# Altium schematic sheet 2014_FDP_STRATEGIE.SchDoc
size A2
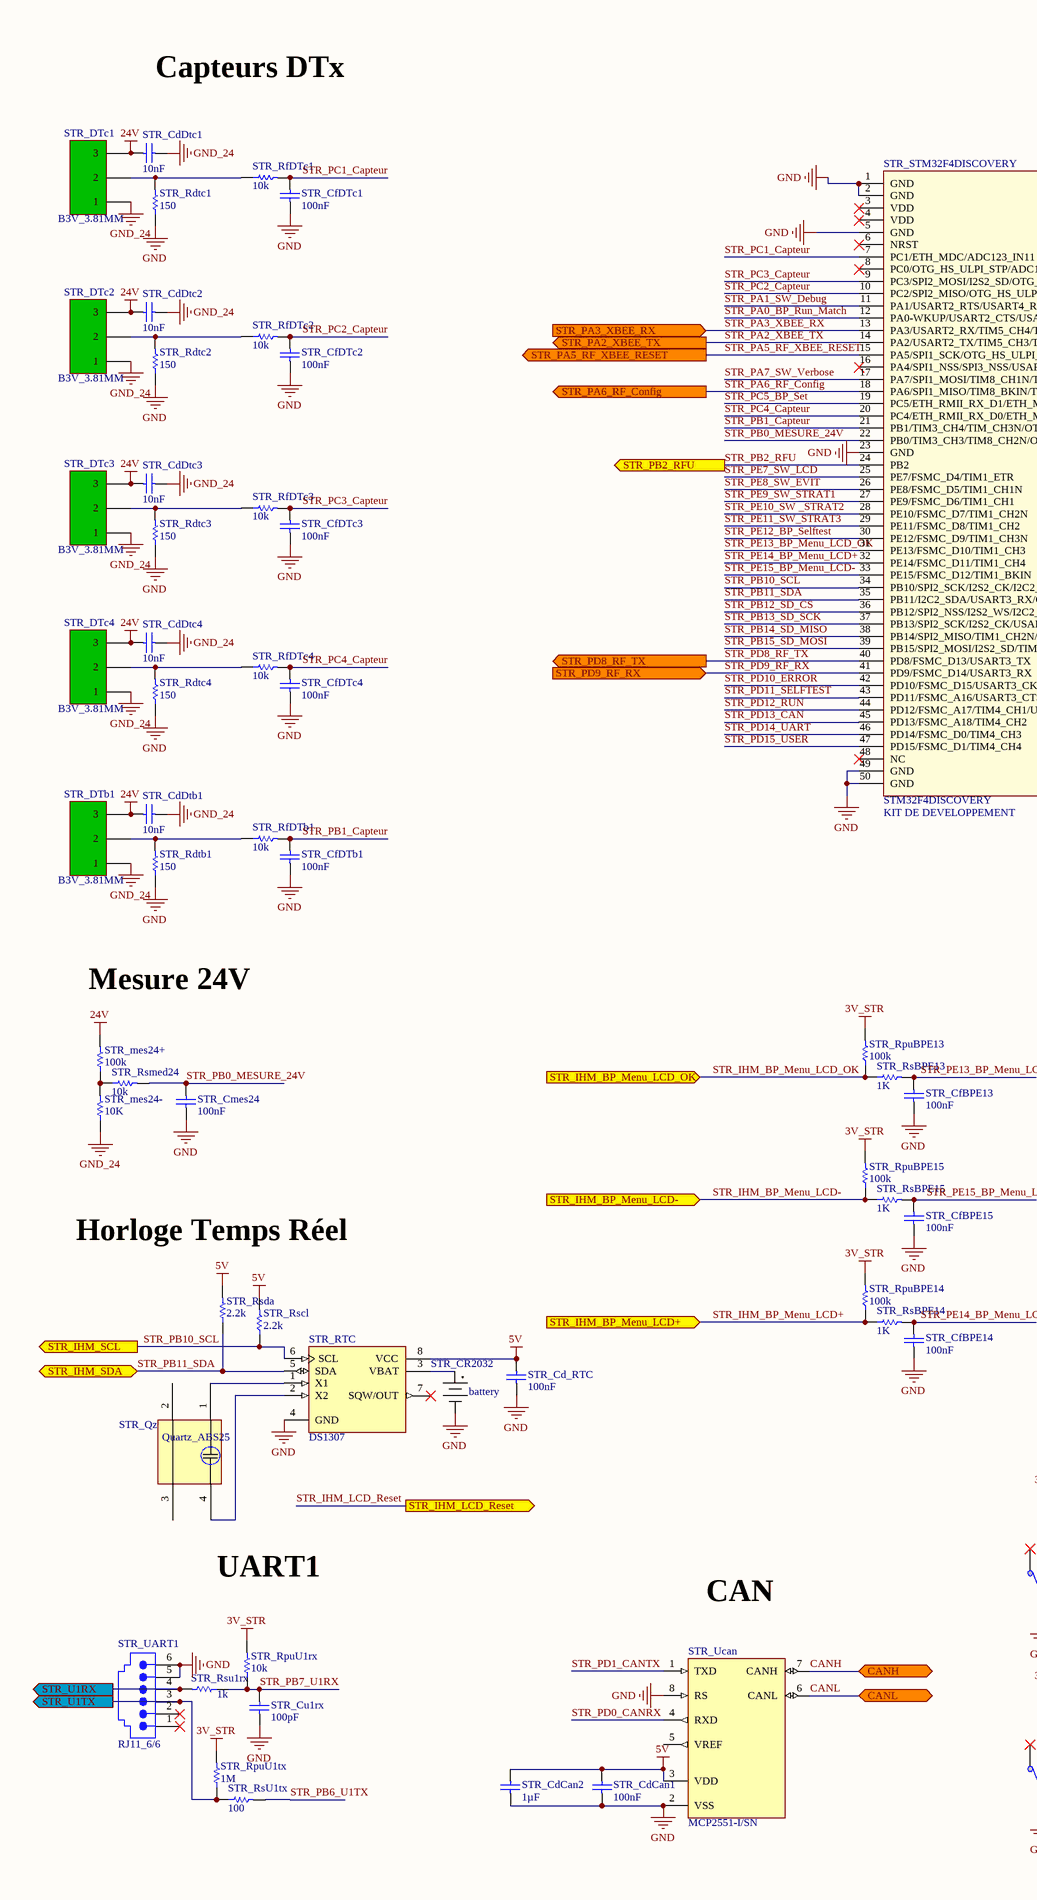
[diagram p0: 2014_FDP_STRATEGIE.SchDoc, left]
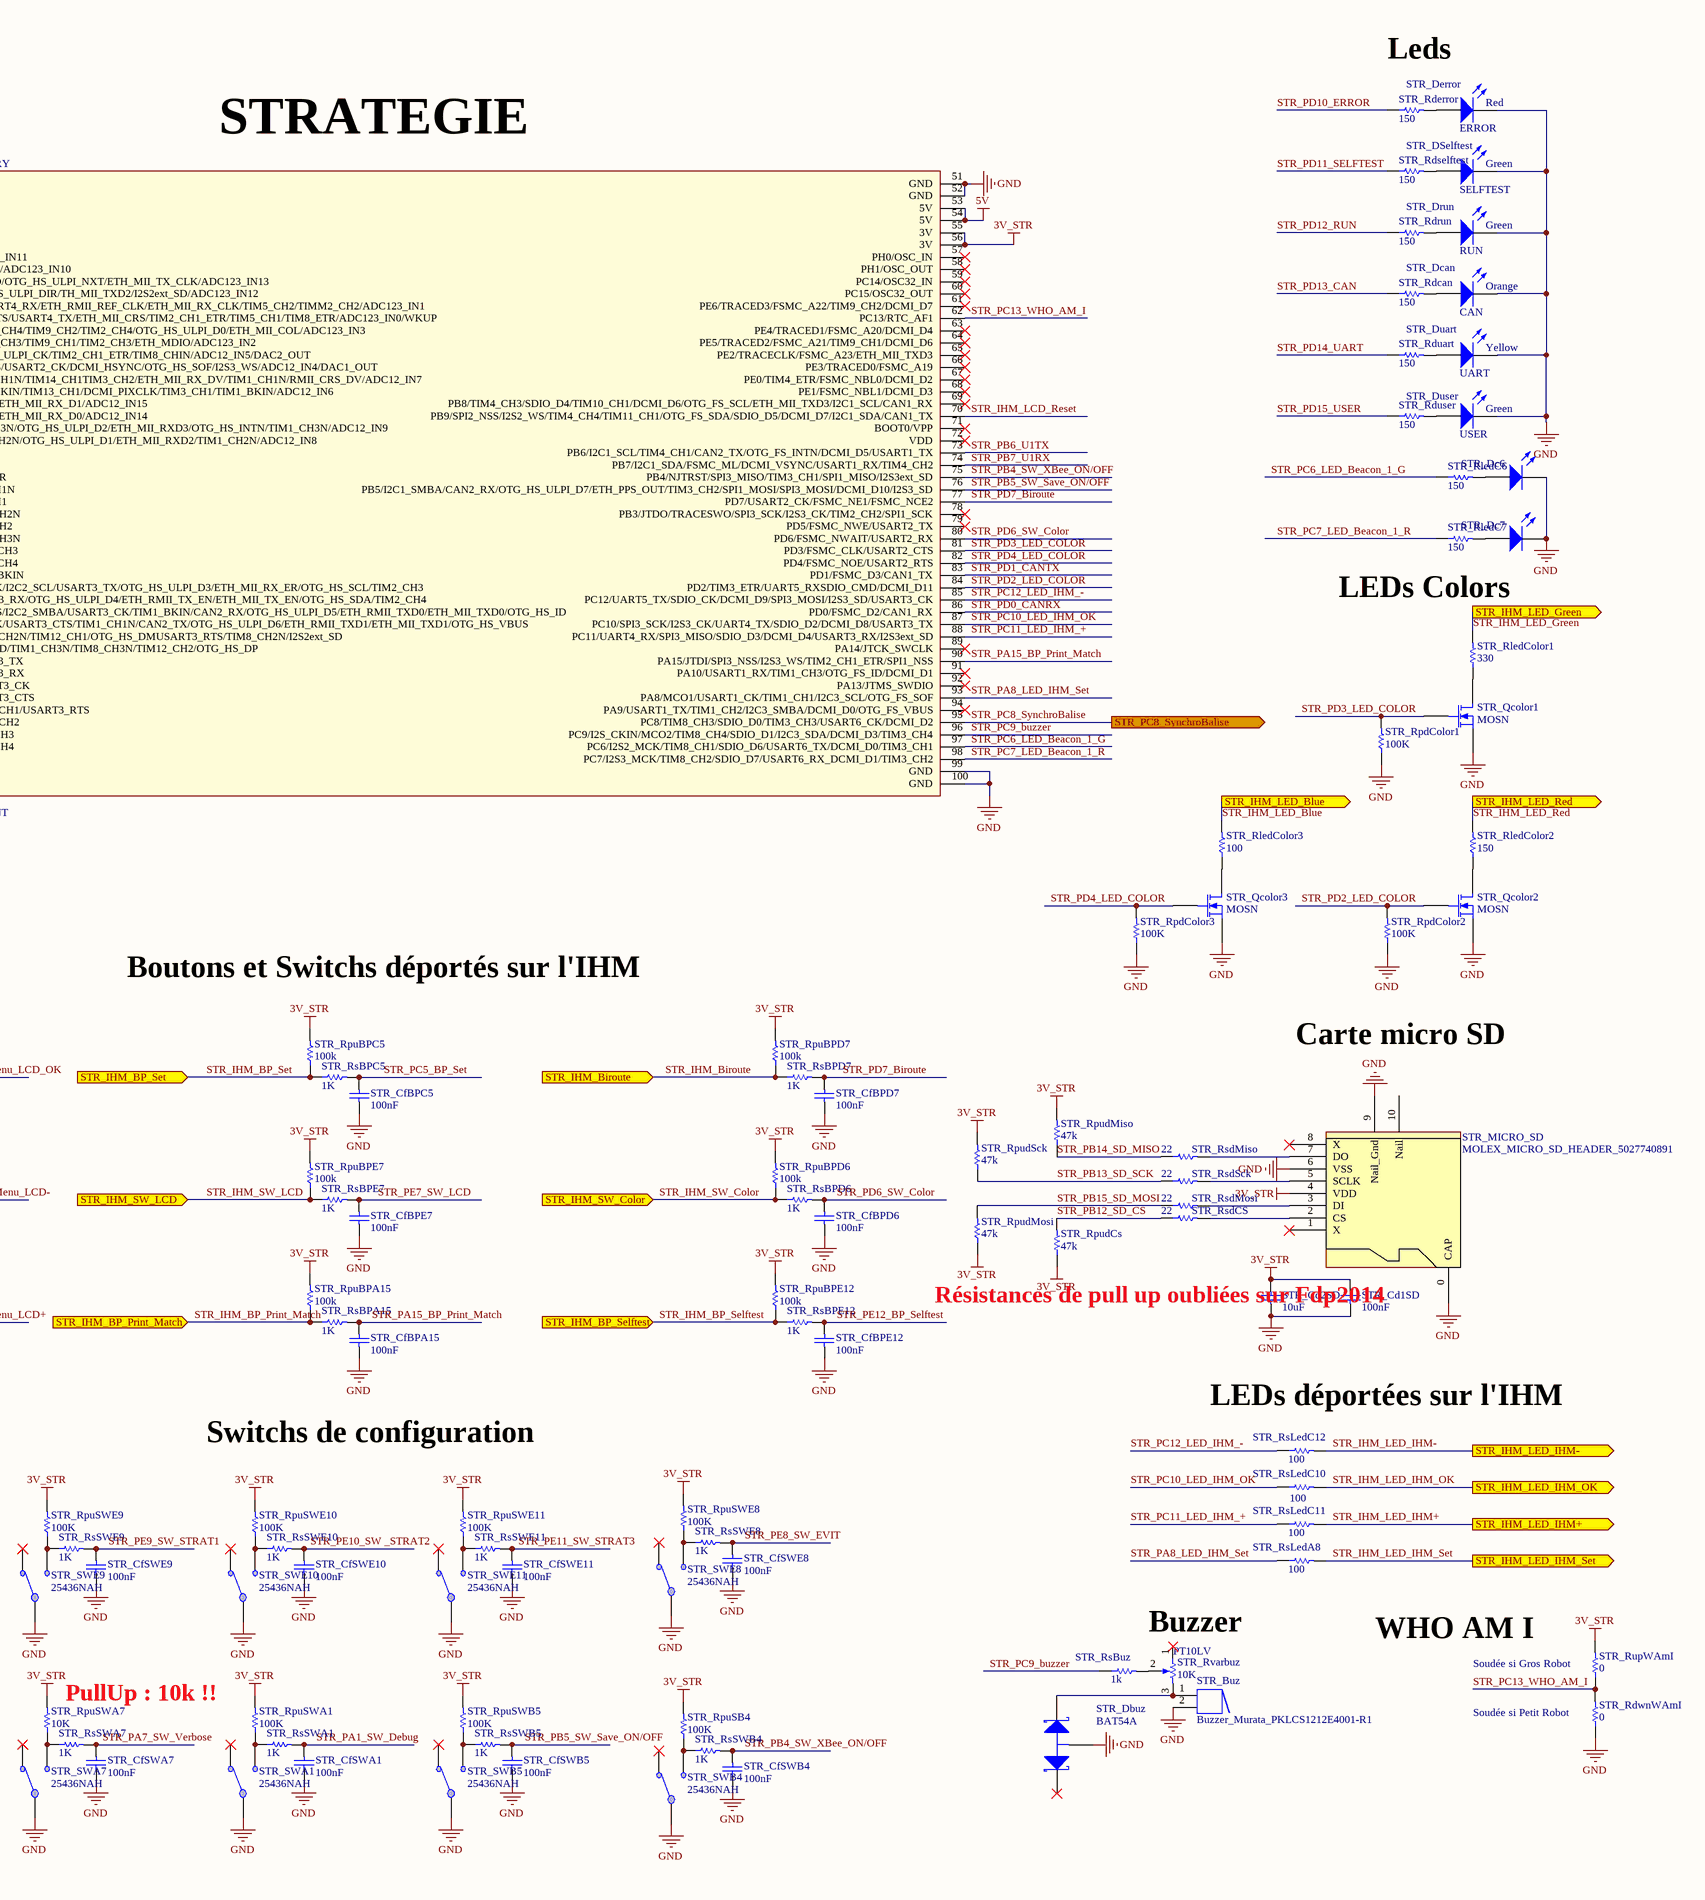
[diagram p1: 2014_FDP_STRATEGIE.SchDoc, right]

## Parts
STR_Buz  Buzzer_Murata_PKLCS1212E4001-R1  [Buzzer_Murata PKLCS1212]
STR_Cd1SD  100nF  [C0805_N]
STR_Cd2SD  10uF  [C1206_N]
STR_Cd_RTC  100nF  [C0805_N]
STR_CdCan1  100nF  [C0805_N]
STR_CdCan2  1µF  [C0805_N]
STR_CdDtb1  10nF  [C0805_N]
STR_CdDtc1  10nF  [C0805_N]
STR_CdDtc2  10nF  [C0805_N]
STR_CdDtc3  10nF  [C0805_N]
STR_CdDtc4  10nF  [C0805_N]
STR_CfBPA15  100nF  [C0805_N]
STR_CfBPC5  100nF  [C0805_N]
STR_CfBPD6  100nF  [C0805_N]
STR_CfBPD7  100nF  [C0805_N]
STR_CfBPE7  100nF  [C0805_N]
STR_CfBPE12  100nF  [C0805_N]
STR_CfBPE13  100nF  [C0805_N]
STR_CfBPE14  100nF  [C0805_N]
STR_CfBPE15  100nF  [C0805_N]
STR_CfDTb1  100nF  [C0805_N]
STR_CfDTc1  100nF  [C0805_N]
STR_CfDTc2  100nF  [C0805_N]
STR_CfDTc3  100nF  [C0805_N]
STR_CfDTc4  100nF  [C0805_N]
STR_CfSWA1  100nF  [C0805_N]
STR_CfSWA7  100nF  [C0805_N]
STR_CfSWB4  100nF  [C0805_N]
STR_CfSWB5  100nF  [C0805_N]
STR_CfSWE8  100nF  [C0805_N]
STR_CfSWE9  100nF  [C0805_N]
STR_CfSWE10  100nF  [C0805_N]
STR_CfSWE11  100nF  [C0805_N]
STR_Cmes24  100nF  [C0805_N]
STR_CR2032  battery  [Pile_boutton]
STR_Cu1rx  100pF  [C0805_N]
STR_Dbuz  BAT54A  [SOT23-3N]
STR_Dc6  ??  [LED_0805]  (value not drawn)
STR_Dc7  ??  [LED_0805]  (value not drawn)
STR_Dcan  CAN  [LED_0805]
STR_Derror  ERROR  [LED_0805]
STR_Drun  RUN  [LED_0805]
STR_DSelftest  SELFTEST  [LED_0805]
STR_DTb1  B3V_3.81MM  [BORNIER_3V_3.81MM]
STR_DTc1  B3V_3.81MM  [BORNIER_3V_3.81MM]
STR_DTc2  B3V_3.81MM  [BORNIER_3V_3.81MM]
STR_DTc3  B3V_3.81MM  [BORNIER_3V_3.81MM]
STR_DTc4  B3V_3.81MM  [BORNIER_3V_3.81MM]
STR_Duart  UART  [LED_0805]
STR_Duser  USER  [LED_0805]
STR_mes24+  100k  [R1206_N]
STR_mes24-  10K  [R1206_N]
STR_MICRO_SD  MOLEX_MICRO_SD_HEADER_5027740891  [MOLEX_MICRO_SD_HEADER_5027740891]
STR_Qcolor1  MOSN  [SOT23-3N]
STR_Qcolor2  MOSN  [SOT23-3N]
STR_Qcolor3  MOSN  [SOT23-3N]
STR_Qz  Quartz_ABS25  [Quartz_ABS25]
STR_Rdcan  150  [R1206_N]
STR_Rderror  150  [R1206_N]
STR_Rdrun  150  [R1206_N]
STR_Rdselftest  150  [R1206_N]
STR_Rdtb1  150  [R1206_N]
STR_Rdtc1  150  [R1206_N]
STR_Rdtc2  150  [R1206_N]
STR_Rdtc3  150  [R1206_N]
STR_Rdtc4  150  [R1206_N]
STR_Rduart  150  [R1206_N]
STR_Rduser  150  [R1206_N]
STR_RdwnWAmI  0  [R1206_N]
STR_RfDTb1  10k  [R1206_N]
STR_RfDTc1  10k  [R1206_N]
STR_RfDTc2  10k  [R1206_N]
STR_RfDTc3  10k  [R1206_N]
STR_RfDTc4  10k  [R1206_N]
STR_RledC6  150  [R1206_N]
STR_RledC7  150  [R1206_N]
STR_RledColor1  330  [R1206_N]
STR_RledColor2  150  [R1206_N]
STR_RledColor3  100  [R1206_N]
STR_RpdColor1  100K  [R1206_N]
STR_RpdColor2  100K  [R1206_N]
STR_RpdColor3  100K  [R1206_N]
STR_RpuBPA15  100k  [R1206_N]
STR_RpuBPC5  100k  [R1206_N]
STR_RpuBPD6  100k  [R1206_N]
STR_RpuBPD7  100k  [R1206_N]
STR_RpuBPE7  100k  [R1206_N]
STR_RpuBPE12  100k  [R1206_N]
STR_RpuBPE13  100k  [R1206_N]
STR_RpuBPE14  100k  [R1206_N]
STR_RpuBPE15  100k  [R1206_N]
STR_RpudCs  47k  [R1206_N]
STR_RpudMiso  47k  [R1206_N]
STR_RpudMosi  47k  [R1206_N]
STR_RpudSck  47k  [R1206_N]
STR_RpuSB4  100K  [R1206_N]
STR_RpuSWA1  100K  [R1206_N]
STR_RpuSWA7  10K  [R1206_N]
STR_RpuSWB5  100K  [R1206_N]
STR_RpuSWE8  100K  [R1206_N]
STR_RpuSWE9  100K  [R1206_N]
STR_RpuSWE10  100K  [R1206_N]
STR_RpuSWE11  100K  [R1206_N]
STR_RpuU1rx  10k  [R1206_N]
STR_RpuU1tx  1M  [R1206_N]
STR_RsBPA15  1K  [R1206_N]
STR_RsBPC5  1K  [R1206_N]
STR_RsBPD6  1K  [R1206_N]
STR_RsBPD7  1K  [R1206_N]
STR_RsBPE7  1K  [R1206_N]
STR_RsBPE12  1K  [R1206_N]
STR_RsBPE13  1K  [R1206_N]
STR_RsBPE14  1K  [R1206_N]
STR_RsBPE15  1K  [R1206_N]
STR_RsBuz  1k  [R1206_N]
STR_Rscl  2.2k  [R1206_N]
STR_Rsda  2.2k  [R1206_N]
STR_RsdCS  22  [R1206_N]
STR_RsdMiso  22  [R1206_N]
STR_RsdMosi  22  [R1206_N]
STR_RsdSck  22  [R1206_N]
STR_RsLedA8  100  [R1206_N]
STR_RsLedC10  100  [R1206_N]
STR_RsLedC11  100  [R1206_N]
STR_RsLedC12  100  [R1206_N]
STR_Rsmed24  10k  [R1206_N]
STR_RsSWA1  1K  [R1206_N]
STR_RsSWA7  1K  [R1206_N]
STR_RsSWB4  1K  [R1206_N]
STR_RsSWB5  1K  [R1206_N]
STR_RsSWE8  1K  [R1206_N]
STR_RsSWE9  1K  [R1206_N]
STR_RsSWE10  1K  [R1206_N]
STR_RsSWE11  1K  [R1206_N]
STR_Rsu1rx  1k  [R1206_N]
STR_RsU1tx  100  [R1206_N]
STR_RTC  DS1307  [SO8_N]
STR_RupWAmI  0  [R1206_N]
STR_Rvarbuz  value 10K  Type: PT10LV  [TRIMMER_MONOTOUR_PT10LV]  (hidden comment: RESISTANCE_VARIABLE_TRAVERSANTE : PT10LV)
STR_STM32F4DISCOVERY  STM32F4DISCOVERY  Type: KIT DE DEVELOPPEMENT  [STM32_F4DISCOVERY]
STR_SWA1  25436NAH  [SW_UNIPOL_DROIT - APEM 18235]
STR_SWA7  25436NAH  [SW_UNIPOL_DROIT - APEM 18235]
STR_SWB4  25436NAH  [SW_UNIPOL_DROIT - APEM 18235]
STR_SWB5  25436NAH  [SW_UNIPOL_DROIT - APEM 18235]
STR_SWE8  25436NAH  [SW_UNIPOL_DROIT - APEM 18235]
STR_SWE9  25436NAH  [SW_UNIPOL_DROIT - APEM 18235]
STR_SWE10  25436NAH  [SW_UNIPOL_DROIT - APEM 18235]
STR_SWE11  25436NAH  [SW_UNIPOL_DROIT - APEM 18235]
STR_UART1  RJ11_6/6  [RJ11_6/6]
STR_Ucan  MCP2551-I/SN  [SO8_N]

## Ports
CANH (bidir), CANL (bidir), STR_IHM_Biroute (in), STR_IHM_BP_Menu_LCD+ (in), STR_IHM_BP_Menu_LCD- (in), STR_IHM_BP_Menu_LCD_OK (in), STR_IHM_BP_Print_Match (in), STR_IHM_BP_Selftest (in), STR_IHM_BP_Set (in), STR_IHM_LCD_Reset (out), STR_IHM_LED_Blue (out), STR_IHM_LED_Green (out), STR_IHM_LED_IHM+ (out), STR_IHM_LED_IHM- (out), STR_IHM_LED_IHM_OK (out), STR_IHM_LED_IHM_Set (out), STR_IHM_LED_Red (out), STR_IHM_SCL (out), STR_IHM_SDA (bidir), STR_IHM_SW_Color (in), STR_IHM_SW_LCD (in), STR_PA2_XBEE_TX (out), STR_PA3_XBEE_RX (in), STR_PA5_RF_XBEE_RESET (out), STR_PA6_RF_Config (out), STR_PB2_RFU (out), STR_PC8_SynchroBalise (out), STR_PD8_RF_TX (out), STR_PD9_RF_RX (in), STR_U1RX (out), STR_U1TX (out)

## Nets
3V_STR: STR_Cd1SD.2 STR_Cd2SD.2 STR_MICRO_SD.4(VDD) STR_RpuBPA15.2 STR_RpuBPC5.2 STR_RpuBPD6.2 STR_RpuBPD7.2 STR_RpuBPE7.2 STR_RpuBPE12.2 STR_RpuBPE13.2 STR_RpuBPE14.2 STR_RpuBPE15.2 STR_RpudCs.1 STR_RpudMiso.2 STR_RpudMosi.1 STR_RpudSck.2 STR_RpuSB4.2 STR_RpuSWA1.2 STR_RpuSWA7.2 STR_RpuSWB5.2 STR_RpuSWE8.2 STR_RpuSWE9.2 STR_RpuSWE10.2 STR_RpuSWE11.2 STR_RpuU1rx.2 STR_RpuU1tx.2 STR_RupWAmI.2 STR_STM32F4DISCOVERY.55(3V) STR_STM32F4DISCOVERY.56(3V)
5V: STR_Cd_RTC.1 STR_CdCan1.2 STR_CdCan2.2 STR_Rscl.2 STR_Rsda.2 STR_RTC.8(VCC) STR_STM32F4DISCOVERY.53(5V) STR_STM32F4DISCOVERY.54(5V) STR_Ucan.3(VDD)
24V: STR_CdDtb1.2 STR_CdDtc1.2 STR_CdDtc2.2 STR_CdDtc3.2 STR_CdDtc4.2 STR_DTb1.3 STR_DTc1.3 STR_DTc2.3 STR_DTc3.3 STR_DTc4.3 STR_mes24+.2
GND: STR_Buz.2 STR_Cd1SD.1 STR_Cd2SD.1 STR_Cd_RTC.2 STR_CdCan1.1 STR_CdCan2.1 STR_CfBPA15.1 STR_CfBPC5.1 STR_CfBPD6.1 STR_CfBPD7.1 STR_CfBPE7.1 STR_CfBPE12.1 STR_CfBPE13.1 STR_CfBPE14.1 STR_CfBPE15.1 STR_CfDTb1.1 STR_CfDTc1.1 STR_CfDTc2.1 STR_CfDTc3.1 STR_CfDTc4.1 STR_CfSWA1.1 STR_CfSWA7.1 STR_CfSWB4.1 STR_CfSWB5.1 STR_CfSWE8.1 STR_CfSWE9.1 STR_CfSWE10.1 STR_CfSWE11.1 STR_Cmes24.1 STR_CR2032.2(-) STR_Cu1rx.1 STR_Dbuz.3(A) STR_Dc6.2(K) STR_Dc7.2(K) STR_Dcan.2(K) STR_Derror.2(K) STR_Drun.2(K) STR_DSelftest.2(K) STR_Duart.2(K) STR_Duser.2(K) STR_MICRO_SD.0(CAP) STR_MICRO_SD.6(VSS) STR_MICRO_SD.9(Nail_Gnd) STR_Qcolor1.2(S) STR_Qcolor2.2(S) STR_Qcolor3.2(S) STR_Rdtb1.1 STR_Rdtc1.1 STR_Rdtc2.1 STR_Rdtc3.1 STR_Rdtc4.1 STR_RdwnWAmI.1 STR_RpdColor1.1 STR_RpdColor2.1 STR_RpdColor3.1 STR_RTC.4(GND) STR_STM32F4DISCOVERY.1(GND) STR_STM32F4DISCOVERY.2(GND) STR_STM32F4DISCOVERY.5(GND) STR_STM32F4DISCOVERY.23(GND) STR_STM32F4DISCOVERY.49(GND) STR_STM32F4DISCOVERY.50(GND) STR_STM32F4DISCOVERY.51(GND) STR_STM32F4DISCOVERY.52(GND) STR_STM32F4DISCOVERY.99(GND) STR_STM32F4DISCOVERY.100(GND) STR_SWA1.COMMON1 STR_SWA7.COMMON1 STR_SWB4.COMMON1 STR_SWB5.COMMON1 STR_SWE8.COMMON1 STR_SWE9.COMMON1 STR_SWE10.COMMON1 STR_SWE11.COMMON1 STR_UART1.5 STR_UART1.6 STR_Ucan.2(VSS) STR_Ucan.8(RS)
GND_24: STR_CdDtb1.1 STR_CdDtc1.1 STR_CdDtc2.1 STR_CdDtc3.1 STR_CdDtc4.1 STR_DTb1.1 STR_DTc1.1 STR_DTc2.1 STR_DTc3.1 STR_DTc4.1 STR_mes24-.1
CANH: STR_Ucan.7(CANH) ; port CANH
CANL: STR_Ucan.6(CANL) ; port CANL
STR_IHM_Biroute: STR_RpuBPD7.1 STR_RsBPD7.1 ; port STR_IHM_Biroute
STR_IHM_BP_Menu_LCD+: STR_RpuBPE14.1 STR_RsBPE14.1 ; port STR_IHM_BP_Menu_LCD+
STR_IHM_BP_Menu_LCD-: STR_RpuBPE15.1 STR_RsBPE15.1 ; port STR_IHM_BP_Menu_LCD-
STR_IHM_BP_Menu_LCD_OK: STR_RpuBPE13.1 STR_RsBPE13.1 ; port STR_IHM_BP_Menu_LCD_OK
STR_IHM_BP_Print_Match: STR_RpuBPA15.1 STR_RsBPA15.1 ; port STR_IHM_BP_Print_Match
STR_IHM_BP_Selftest: STR_RpuBPE12.1 STR_RsBPE12.1 ; port STR_IHM_BP_Selftest
STR_IHM_BP_Set: STR_RpuBPC5.1 STR_RsBPC5.1 ; port STR_IHM_BP_Set
STR_IHM_LCD_Reset: STR_STM32F4DISCOVERY.70(PB9/SPI2_NSS/I2S2_WS/TIM4_CH4/TIM11_CH1/OTG_FS_SDA/SDIO_D5/DCMI_D7/I2C1_SDA/CAN1_TX) ; port STR_IHM_LCD_Reset
STR_IHM_LED_Blue: STR_RledColor3.2 ; port STR_IHM_LED_Blue
STR_IHM_LED_Green: STR_RledColor1.2 ; port STR_IHM_LED_Green
STR_IHM_LED_IHM+: STR_RsLedC11.2 ; port STR_IHM_LED_IHM+
STR_IHM_LED_IHM-: STR_RsLedC12.2 ; port STR_IHM_LED_IHM-
STR_IHM_LED_IHM_OK: STR_RsLedC10.2 ; port STR_IHM_LED_IHM_OK
STR_IHM_LED_IHM_Set: STR_RsLedA8.2 ; port STR_IHM_LED_IHM_Set
STR_IHM_LED_Red: STR_RledColor2.2 ; port STR_IHM_LED_Red
STR_IHM_SW_Color: STR_RpuBPD6.1 STR_RsBPD6.1 ; port STR_IHM_SW_Color
STR_IHM_SW_LCD: STR_RpuBPE7.1 STR_RsBPE7.1 ; port STR_IHM_SW_LCD
STR_PA0_BP_Run_Match: STR_STM32F4DISCOVERY.12(PA0-WKUP/USART2_CTS/USART4_TX/ETH_MII_CRS/TIM2_CH1_ETR/TIM5_CH1/TIM8_ETR/ADC123_IN0/WKUP)
STR_PA1_SW_Debug: STR_CfSWA1.2 STR_RsSWA1.2 STR_STM32F4DISCOVERY.11(PA1/USART2_RTS/USART4_RX/ETH_RMII_REF_CLK/ETH_MII_RX_CLK/TIM5_CH2/TIMM2_CH2/ADC123_IN1)
STR_PA2_XBEE_TX: STR_STM32F4DISCOVERY.14(PA2/USART2_TX/TIM5_CH3/TIM9_CH1/TIM2_CH3/ETH_MDIO/ADC123_IN2) ; port STR_PA2_XBEE_TX
STR_PA3_XBEE_RX: STR_STM32F4DISCOVERY.13(PA3/USART2_RX/TIM5_CH4/TIM9_CH2/TIM2_CH4/OTG_HS_ULPI_D0/ETH_MII_COL/ADC123_IN3) ; port STR_PA3_XBEE_RX
STR_PA5_RF_XBEE_RESET: STR_STM32F4DISCOVERY.15(PA5/SPI1_SCK/OTG_HS_ULPI_CK/TIM2_CH1_ETR/TIM8_CHIN/ADC12_IN5/DAC2_OUT) ; port STR_PA5_RF_XBEE_RESET
STR_PA6_RF_Config: STR_STM32F4DISCOVERY.18(PA6/SPI1_MISO/TIM8_BKIN/TIM13_CH1/DCMI_PIXCLK/TIM3_CH1/TIM1_BKIN/ADC12_IN6) ; port STR_PA6_RF_Config
STR_PA7_SW_Verbose: STR_CfSWA7.2 STR_RsSWA7.2 STR_STM32F4DISCOVERY.17(PA7/SPI1_MOSI/TIM8_CH1N/TIM14_CH1TIM3_CH2/ETH_MII_RX_DV/TIM1_CH1N/RMII_CRS_DV/ADC12_IN7)
STR_PA8_LED_IHM_Set: STR_RsLedA8.1 STR_STM32F4DISCOVERY.93(PA8/MCO1/USART1_CK/TIM1_CH1/I2C3_SCL/OTG_FS_SOF)
STR_PA15_BP_Print_Match: STR_CfBPA15.2 STR_RsBPA15.2 STR_STM32F4DISCOVERY.90(PA15/JTDI/SPI3_NSS/I2S3_WS/TIM2_CH1_ETR/SPI1_NSS)
STR_PB0_MESURE_24V: STR_Cmes24.2 STR_Rsmed24.2 STR_STM32F4DISCOVERY.22(PB0/TIM3_CH3/TIM8_CH2N/OTG_HS_ULPI_D1/ETH_MII_RXD2/TIM1_CH2N/ADC12_IN8)
STR_PB1_Capteur: STR_CfDTb1.2 STR_RfDTb1.2 STR_STM32F4DISCOVERY.21(PB1/TIM3_CH4/TIM_CH3N/OTG_HS_ULPI_D2/ETH_MII_RXD3/OTG_HS_INTN/TIM1_CH3N/ADC12_IN9)
STR_PB2_RFU: STR_STM32F4DISCOVERY.24(PB2) ; port STR_PB2_RFU
STR_PB4_SW_XBee_ON/OFF: STR_CfSWB4.2 STR_RsSWB4.2 STR_STM32F4DISCOVERY.75(PB4/NJTRST/SPI3_MISO/TIM3_CH1/SPI1_MISO/I2S3ext_SD)
STR_PB5_SW_Save_ON/OFF: STR_CfSWB5.2 STR_RsSWB5.2 STR_STM32F4DISCOVERY.76(PB5/I2C1_SMBA/CAN2_RX/OTG_HS_ULPI_D7/ETH_PPS_OUT/TIM3_CH2/SPI1_MOSI/SPI3_MOSI/DCMI_D10/I2S3_SD)
STR_PB6_U1TX: STR_RsU1tx.2 STR_STM32F4DISCOVERY.73(PB6/I2C1_SCL/TIM4_CH1/CAN2_TX/OTG_FS_INTN/DCMI_D5/USART1_TX)
STR_PB7_U1RX: STR_Cu1rx.2 STR_RpuU1rx.1 STR_Rsu1rx.1 STR_STM32F4DISCOVERY.74(PB7/I2C1_SDA/FSMC_ML/DCMI_VSYNC/USART1_RX/TIM4_CH2)
STR_PB10_SCL: STR_Rscl.1 STR_RTC.6(SCL) STR_STM32F4DISCOVERY.34(PB10/SPI2_SCK/I2S2_CK/I2C2_SCL/USART3_TX/OTG_HS_ULPI_D3/ETH_MII_RX_ER/OTG_HS_SCL/TIM2_CH3) ; port STR_IHM_SCL
STR_PB11_SDA: STR_Rsda.1 STR_RTC.5(SDA) STR_STM32F4DISCOVERY.35(PB11/I2C2_SDA/USART3_RX/OTG_HS_ULPI_D4/ETH_RMII_TX_EN/ETH_MII_TX_EN/OTG_HS_SDA/TIM2_CH4) ; port STR_IHM_SDA
STR_PB12_SD_CS: STR_RpudCs.2 STR_RsdCS.1 STR_STM32F4DISCOVERY.36(PB12/SPI2_NSS/I2S2_WS/I2C2_SMBA/USART3_CK/TIM1_BKIN/CAN2_RX/OTG_HS_ULPI_D5/ETH_RMII_TXD0/ETH_MII_TXD0/OTG_HS_ID)
STR_PB13_SD_SCK: STR_RpudSck.1 STR_RsdSck.1 STR_STM32F4DISCOVERY.37(PB13/SPI2_SCK/I2S2_CK/USART3_CTS/TIM1_CH1N/CAN2_TX/OTG_HS_ULPI_D6/ETH_RMII_TXD1/ETH_MII_TXD1/OTG_HS_VBUS)
STR_PB14_SD_MISO: STR_RpudMiso.1 STR_RsdMiso.1 STR_STM32F4DISCOVERY.38(PB14/SPI2_MISO/TIM1_CH2N/TIM12_CH1/OTG_HS_DMUSART3_RTS/TIM8_CH2N/I2S2ext_SD)
STR_PB15_SD_MOSI: STR_RpudMosi.2 STR_RsdMosi.1 STR_STM32F4DISCOVERY.39(PB15/SPI2_MOSI/I2S2_SD/TIM1_CH3N/TIM8_CH3N/TIM12_CH2/OTG_HS_DP)
STR_PC1_Capteur: STR_CfDTc1.2 STR_RfDTc1.2 STR_STM32F4DISCOVERY.7(PC1/ETH_MDC/ADC123_IN11)
STR_PC2_Capteur: STR_CfDTc2.2 STR_RfDTc2.2 STR_STM32F4DISCOVERY.10(PC2/SPI2_MISO/OTG_HS_ULPI_DIR/TH_MII_TXD2/I2S2ext_SD/ADC123_IN12)
STR_PC3_Capteur: STR_CfDTc3.2 STR_RfDTc3.2 STR_STM32F4DISCOVERY.9(PC3/SPI2_MOSI/I2S2_SD/OTG_HS_ULPI_NXT/ETH_MII_TX_CLK/ADC123_IN13)
STR_PC4_Capteur: STR_CfDTc4.2 STR_RfDTc4.2 STR_STM32F4DISCOVERY.20(PC4/ETH_RMII_RX_D0/ETH_MII_RX_D0/ADC12_IN14)
STR_PC5_BP_Set: STR_CfBPC5.2 STR_RsBPC5.2 STR_STM32F4DISCOVERY.19(PC5/ETH_RMII_RX_D1/ETH_MII_RX_D1/ADC12_IN15)
STR_PC6_LED_Beacon_1_G: STR_RledC6.1 STR_STM32F4DISCOVERY.97(PC6/I2S2_MCK/TIM8_CH1/SDIO_D6/USART6_TX/DCMI_D0/TIM3_CH1)
STR_PC7_LED_Beacon_1_R: STR_RledC7.1 STR_STM32F4DISCOVERY.98(PC7/I2S3_MCK/TIM8_CH2/SDIO_D7/USART6_RX_DCMI_D1/TIM3_CH2)
STR_PC8_SynchroBalise: STR_STM32F4DISCOVERY.95(PC8/TIM8_CH3/SDIO_D0/TIM3_CH3/USART6_CK/DCMI_D2) ; port STR_PC8_SynchroBalise
STR_PC9_buzzer: STR_RsBuz.1 STR_STM32F4DISCOVERY.96(PC9/I2S_CKIN/MCO2/TIM8_CH4/SDIO_D1/I2C3_SDA/DCMI_D3/TIM3_CH4)
STR_PC10_LED_IHM_OK: STR_RsLedC10.1 STR_STM32F4DISCOVERY.87(PC10/SPI3_SCK/I2S3_CK/UART4_TX/SDIO_D2/DCMI_D8/USART3_TX)
STR_PC11_LED_IHM_+: STR_RsLedC11.1 STR_STM32F4DISCOVERY.88(PC11/UART4_RX/SPI3_MISO/SDIO_D3/DCMI_D4/USART3_RX/I2S3ext_SD)
STR_PC12_LED_IHM_-: STR_RsLedC12.1 STR_STM32F4DISCOVERY.85(PC12/UART5_TX/SDIO_CK/DCMI_D9/SPI3_MOSI/I2S3_SD/USART3_CK)
STR_PC13_WHO_AM_I: STR_RdwnWAmI.2 STR_RupWAmI.1 STR_STM32F4DISCOVERY.62(PC13/RTC_AF1)
STR_PD0_CANRX: STR_STM32F4DISCOVERY.86(PD0/FSMC_D2/CAN1_RX) STR_Ucan.4(RXD)
STR_PD1_CANTX: STR_STM32F4DISCOVERY.83(PD1/FSMC_D3/CAN1_TX) STR_Ucan.1(TXD)
STR_PD2_LED_COLOR: STR_Qcolor2.1(G) STR_RpdColor2.2 STR_STM32F4DISCOVERY.84(PD2/TIM3_ETR/UART5_RXSDIO_CMD/DCMI_D11)
STR_PD3_LED_COLOR: STR_Qcolor1.1(G) STR_RpdColor1.2 STR_STM32F4DISCOVERY.81(PD3/FSMC_CLK/USART2_CTS)
STR_PD4_LED_COLOR: STR_Qcolor3.1(G) STR_RpdColor3.2 STR_STM32F4DISCOVERY.82(PD4/FSMC_NOE/USART2_RTS)
STR_PD6_SW_Color: STR_CfBPD6.2 STR_RsBPD6.2 STR_STM32F4DISCOVERY.80(PD6/FSMC_NWAIT/USART2_RX)
STR_PD7_Biroute: STR_CfBPD7.2 STR_RsBPD7.2 STR_STM32F4DISCOVERY.77(PD7/USART2_CK/FSMC_NE1/FSMC_NCE2)
STR_PD8_RF_TX: STR_STM32F4DISCOVERY.40(PD8/FSMC_D13/USART3_TX) ; port STR_PD8_RF_TX
STR_PD9_RF_RX: STR_STM32F4DISCOVERY.41(PD9/FSMC_D14/USART3_RX) ; port STR_PD9_RF_RX
STR_PD10_ERROR: STR_Rderror.1 STR_STM32F4DISCOVERY.42(PD10/FSMC_D15/USART3_CK)
STR_PD11_SELFTEST: STR_Rdselftest.1 STR_STM32F4DISCOVERY.43(PD11/FSMC_A16/USART3_CTS)
STR_PD12_RUN: STR_Rdrun.1 STR_STM32F4DISCOVERY.44(PD12/FSMC_A17/TIM4_CH1/USART3_RTS)
STR_PD13_CAN: STR_Rdcan.1 STR_STM32F4DISCOVERY.45(PD13/FSMC_A18/TIM4_CH2)
STR_PD14_UART: STR_Rduart.1 STR_STM32F4DISCOVERY.46(PD14/FSMC_D0/TIM4_CH3)
STR_PD15_USER: STR_Rduser.1 STR_STM32F4DISCOVERY.47(PD15/FSMC_D1/TIM4_CH4)
STR_PE7_SW_LCD: STR_CfBPE7.2 STR_RsBPE7.2 STR_STM32F4DISCOVERY.25(PE7/FSMC_D4/TIM1_ETR)
STR_PE8_SW_EVIT: STR_CfSWE8.2 STR_RsSWE8.2 STR_STM32F4DISCOVERY.26(PE8/FSMC_D5/TIM1_CH1N)
STR_PE9_SW_STRAT1: STR_CfSWE9.2 STR_RsSWE9.2 STR_STM32F4DISCOVERY.27(PE9/FSMC_D6/TIM1_CH1)
STR_PE10_SW _STRAT2: STR_CfSWE10.2 STR_RsSWE10.2 STR_STM32F4DISCOVERY.28(PE10/FSMC_D7/TIM1_CH2N)
STR_PE11_SW_STRAT3: STR_CfSWE11.2 STR_RsSWE11.2 STR_STM32F4DISCOVERY.29(PE11/FSMC_D8/TIM1_CH2)
STR_PE12_BP_Selftest: STR_CfBPE12.2 STR_RsBPE12.2 STR_STM32F4DISCOVERY.30(PE12/FSMC_D9/TIM1_CH3N)
STR_PE13_BP_Menu_LCD_OK: STR_CfBPE13.2 STR_RsBPE13.2 STR_STM32F4DISCOVERY.31(PE13/FSMC_D10/TIM1_CH3)
STR_PE14_BP_Menu_LCD+: STR_CfBPE14.2 STR_RsBPE14.2 STR_STM32F4DISCOVERY.32(PE14/FSMC_D11/TIM1_CH4)
STR_PE15_BP_Menu_LCD-: STR_CfBPE15.2 STR_RsBPE15.2 STR_STM32F4DISCOVERY.33(PE15/FSMC_D12/TIM1_BKIN)
STR_U1RX: STR_Rsu1rx.2 STR_UART1.4 ; port STR_U1RX
STR_U1TX: STR_RpuU1tx.1 STR_RsU1tx.1 STR_UART1.3 ; port STR_U1TX
NetSTR_Buz_1: STR_Buz.1 STR_Dbuz.1(K1) STR_Rvarbuz.3
NetSTR_CR2032_1: STR_CR2032.1(+) STR_RTC.3(VBAT)
NetSTR_Dc6_1: STR_Dc6.1(A) STR_RledC6.2
NetSTR_Dc7_1: STR_Dc7.1(A) STR_RledC7.2
NetSTR_Dcan_1: STR_Dcan.1(A) STR_Rdcan.2
NetSTR_Derror_1: STR_Derror.1(A) STR_Rderror.2
NetSTR_Drun_1: STR_Drun.1(A) STR_Rdrun.2
NetSTR_DSelftest_1: STR_DSelftest.1(A) STR_Rdselftest.2
NetSTR_DTb1_2: STR_DTb1.2 STR_Rdtb1.2 STR_RfDTb1.1
NetSTR_DTc1_2: STR_DTc1.2 STR_Rdtc1.2 STR_RfDTc1.1
NetSTR_DTc2_2: STR_DTc2.2 STR_Rdtc2.2 STR_RfDTc2.1
NetSTR_DTc3_2: STR_DTc3.2 STR_Rdtc3.2 STR_RfDTc3.1
NetSTR_DTc4_2: STR_DTc4.2 STR_Rdtc4.2 STR_RfDTc4.1
NetSTR_Duart_1: STR_Duart.1(A) STR_Rduart.2
NetSTR_Duser_1: STR_Duser.1(A) STR_Rduser.2
NetSTR_mes24+_1: STR_mes24+.1 STR_mes24-.2 STR_Rsmed24.1
NetSTR_MICRO_SD_2: STR_MICRO_SD.2(CS) STR_RsdCS.2
NetSTR_MICRO_SD_3: STR_MICRO_SD.3(DI) STR_RsdMosi.2
NetSTR_MICRO_SD_5: STR_MICRO_SD.5(SCLK) STR_RsdSck.2
NetSTR_MICRO_SD_7: STR_MICRO_SD.7(DO) STR_RsdMiso.2
NetSTR_Qcolor1_3: STR_Qcolor1.3(D) STR_RledColor1.1
NetSTR_Qcolor2_3: STR_Qcolor2.3(D) STR_RledColor2.1
NetSTR_Qcolor3_3: STR_Qcolor3.3(D) STR_RledColor3.1
NetSTR_Qz_1: STR_Qz.1 STR_RTC.1(X1)
NetSTR_Qz_4: STR_Qz.4 STR_RTC.2(X2)
NetSTR_RpuSB4_1: STR_RpuSB4.1 STR_RsSWB4.1 STR_SWB4.NO1
NetSTR_RpuSWA1_1: STR_RpuSWA1.1 STR_RsSWA1.1 STR_SWA1.NO1
NetSTR_RpuSWA7_1: STR_RpuSWA7.1 STR_RsSWA7.1 STR_SWA7.NO1
NetSTR_RpuSWB5_1: STR_RpuSWB5.1 STR_RsSWB5.1 STR_SWB5.NO1
NetSTR_RpuSWE8_1: STR_RpuSWE8.1 STR_RsSWE8.1 STR_SWE8.NO1
NetSTR_RpuSWE9_1: STR_RpuSWE9.1 STR_RsSWE9.1 STR_SWE9.NO1
NetSTR_RpuSWE10_1: STR_RpuSWE10.1 STR_RsSWE10.1 STR_SWE10.NO1
NetSTR_RpuSWE11_1: STR_RpuSWE11.1 STR_RsSWE11.1 STR_SWE11.NO1
NetSTR_RsBuz_2: STR_RsBuz.2 STR_Rvarbuz.2

Not connected (* = marked no-connect by the designer): STR_Dbuz 2(K2)*; STR_MICRO_SD 1(X)* 8(X)* 10(Nail); STR_Qz 2 3; STR_RTC 7(SQW/OUT)*; STR_Rvarbuz 1*; STR_STM32F4DISCOVERY 3(VDD)* 4(VDD)* 6(NRST)* 8(PC0/OTG_HS_ULPI_STP/ADC123_IN10)* 16(PA4/SPI1_NSS/SPI3_NSS/USART2_CK/DCMI_HSYNC/OTG_HS_SOF/I2S3_WS/ADC12_IN4/DAC1_OUT)* 48(NC)* 57(PH0/OSC_IN)* 58(PH1/OSC_OUT)* 59(PC14/OSC32_IN)* 60(PC15/OSC32_OUT)* 61(PE6/TRACED3/FSMC_A22/TIM9_CH2/DCMI_D7)* 63(PE4/TRACED1/FSMC_A20/DCMI_D4)* 64(PE5/TRACED2/FSMC_A21/TIM9_CH1/DCMI_D6)* 65(PE2/TRACECLK/FSMC_A23/ETH_MII_TXD3)* 66(PE3/TRACED0/FSMC_A19)* 67(PE0/TIM4_ETR/FSMC_NBL0/DCMI_D2)* 68(PE1/FSMC_NBL1/DCMI_D3)* 69(PB8/TIM4_CH3/SDIO_D4/TIM10_CH1/DCMI_D6/OTG_FS_SCL/ETH_MII_TXD3/I2C1_SCL/CAN1_RX)* 71(BOOT0/VPP)* 72(VDD)* 78(PB3/JTDO/TRACESWO/SPI3_SCK/I2S3_CK/TIM2_CH2/SPI1_SCK)* 79(PD5/FSMC_NWE/USART2_TX)* 89(PA14/JTCK_SWCLK)* 91(PA10/USART1_RX/TIM1_CH3/OTG_FS_ID/DCMI_D1)* 92(PA13/JTMS_SWDIO)* 94(PA9/USART1_TX/TIM1_CH2/I2C3_SMBA/DCMI_D0/OTG_FS_VBUS)*; STR_SWA1 NC1*; STR_SWA7 NC1*; STR_SWB4 NC1*; STR_SWB5 NC1*; STR_SWE8 NC1*; STR_SWE9 NC1*; STR_SWE10 NC1*; STR_SWE11 NC1*; STR_UART1 1* 2*; STR_Ucan 5(VREF)

## Notes on the sheet
- Capteurs DTx
- Leds
- (near STR_Derror) Red
- (near STR_STM32F4DISCOVERY) STRATEGIE
- (near STR_DSelftest) Green
- (near STR_Drun) Green
- (near STR_Dcan) Orange
- (near STR_Duart) Yellow
- (near STR_Duser) Green
- LEDs Colors
- Mesure 24V
- Boutons et Switchs déportés sur l'IHM
- Carte micro SD
- Horloge Temps Réel
- Résistances de pull up oubliées sur Fdp2014
- Switchs de configuration
- (near STR_RsLedC12) LEDs déportées sur l'IHM
- UART1
- CAN
- (near STR_Rvarbuz) Buzzer
- WHO AM I
- (near STR_RupWAmI) Soudée si Gros Robot
- (near STR_RpuSWA1) PullUp : 10k !!
- (near STR_RdwnWAmI) Soudée si Petit Robot
- Title
- Size:
- Date:
- File:
- A2
- Number:
- Time:
- Revision:
- Sheet
- of

## Library data of the parts
STR_Buz = Buzzer_Murata_PKLCS1212E4001-R1: Manufacturer Description: MURATA - PKLCS1212E4001-R1 - BUZZER CMS 4KHZ; Manufacturer: MURATA; Manufacturer Part Number: PKLCS1212E4001-R1; Supplier 1: Farnell; Supplier Part Number 1: 1192551; Supplier 2: Newark; Supplier Part Number 2: 01M8494; Supplier 3: Mouser; Supplier Part Number 3: 81-PKLCS1212E4001
STR_Cd1SD STR_Cd2SD STR_Cd_RTC STR_CdCan1 STR_CdCan2 STR_CdDtb1 STR_CdDtc1-STR_CdDtc4 STR_CfBPA15 STR_CfBPC5 STR_CfBPD6 STR_CfBPD7 STR_CfBPE7 STR_CfBPE12-STR_CfBPE15 STR_CfDTb1 STR_CfDTc1-STR_CfDTc4 STR_CfSWA1 STR_CfSWA7 STR_CfSWB4 STR_CfSWB5 STR_CfSWE8-STR_CfSWE11 STR_Cmes24 STR_Cu1rx = Condensateur: Capacitor; Published: 8-Jun-2000; LatestRevisionDate: 17-Jul-2002; LatestRevisionNote: Re-released for DXP Platform.; PackageReference: RAD-0.3; Publisher: Altium Limited
STR_CR2032 = battery: Battery, Pile; Tech: CMOS; Eco Plan: RoHS Compliant; ComponentLink0Description: PIN assignation for the battery component; ComponentLink1Description: Manufacturer Link; ComponentLink2Description: Handbook; ComponentLink3Description: Packaging Specification; Created: 08-08-07; LatestRevisionDate: 08-08-07; LatestRevisionNote: creation; PackageDescription: 2-pins; PackageVersion: ver1.0, Aug-2007; Published: 03-07-07; Publisher: Jean-Philippe Oudet; Type: Alim
STR_Dbuz = Diode Shottky double  BAT54A: DIODE SCHOTTKY DOUBLE; Manufacturer: ZETEX; Description: ZETEX - BAT54A - DIODE SCHOTTKY DOUBLE; ComponentLink1URL: http://www.farnell.com/datasheets/27632.pdf; ComponentLink1Description: http://www.farnell.com/datasheets/27632.pdf; Supplier Part Number: 9526498; Supplier: Farnell; RoHS: YES; Manufacturer Part Number: BAT54A
STR_Dc6 STR_Dc7 STR_Dcan STR_Derror STR_Drun STR_DSelftest STR_Duart STR_Duser = LED: Typical LED; Published: 8-Jun-2000; LatestRevisionDate: 08-Jul-2005; LatestRevisionNote: Mech Layer 1 removed.; PackageReference: LED-1; Publisher: Altium Limited
STR_DTb1 STR_DTc1-STR_DTc4 = BORNIER_3V_3.81MM
STR_mes24+ STR_mes24- STR_Rdcan STR_Rderror STR_Rdrun STR_Rdselftest STR_Rdtb1 STR_Rdtc1-STR_Rdtc4 STR_Rduart STR_Rduser STR_RdwnWAmI STR_RfDTb1 STR_RfDTc1-STR_RfDTc4 STR_RledC6 STR_RledC7 STR_RledColor1-STR_RledColor3 STR_RpdColor1-STR_RpdColor3 STR_RpuBPA15 STR_RpuBPC5 STR_RpuBPD6 STR_RpuBPD7 STR_RpuBPE7 STR_RpuBPE12-STR_RpuBPE15 STR_RpudCs STR_RpudMiso STR_RpudMosi STR_RpudSck STR_RpuSB4 STR_RpuSWA1 STR_RpuSWA7 STR_RpuSWB5 STR_RpuSWE8-STR_RpuSWE11 STR_RpuU1rx STR_RpuU1tx STR_RsBPA15 STR_RsBPC5 STR_RsBPD6 STR_RsBPD7 STR_RsBPE7 STR_RsBPE12-STR_RsBPE15 STR_RsBuz STR_Rscl STR_Rsda STR_RsdCS STR_RsdMiso STR_RsdMosi STR_RsdSck STR_RsLedA8 STR_RsLedC10-STR_RsLedC12 STR_Rsmed24 STR_RsSWA1 STR_RsSWA7 STR_RsSWB4 STR_RsSWB5 STR_RsSWE8-STR_RsSWE11 STR_Rsu1rx STR_RsU1tx STR_RupWAmI = Resistor: Published: 8-Jun-2000; LatestRevisionDate: 17-Jul-2002; LatestRevisionNote: Re-released for DXP Platform.; PackageReference: AXIAL-0.5; Publisher: Altium Limited
STR_Qcolor1-STR_Qcolor3 = Transistor MOSFET-N: N-Channel MOSFET; PackageDocument: 1995/1996; Published: 8-Jun-2000; LatestRevisionDate: 17-Jul-2002; LatestRevisionNote: Re-released for DXP Platform.; PackageReference: E3; Publisher: Altium Limited
STR_RTC = DS1307: 64 X 8 Serial Real-Time Clock; Published: 13-Oct-2000; LatestRevisionDate: 06-Jun-2005; LatestRevisionNote: Stylized 3D Model Added.; DatasheetVersion: 10-Aug-1999; PackageVersion: 1999; PackageReference: DIP8; Publisher: Altium Limited; PackageDescription: DIP; 8 Leads; Row Spacing 7.62 mm; Pitch 2.54 mm; ComponentLink1Description: Manufacturer Link; ComponentLink1URL: http://www.maxim-ic.com/; ComponentLink2Description: Datasheet; ComponentLink2URL: http://pdfserv.maxim-ic.com/en/ds/DS1307.pdf; ComponentLink3Description: Discontinuation Notice; ComponentLink3URL: http://www.maxim-ic.com/qa/pdfs/non-obsolescence-letter.pdf
STR_Rvarbuz = RESISTANCE_VARIABLE_TRAVERSANTE : PT10LV: RESISTANCE VARIABLE_TRAVERSANTE : PT10LV
STR_STM32F4DISCOVERY = STM32F4DISCOVERY: KIT DE DEVELOPPEMENT POUR MICROCONTROLEUR STM32F407VGT6
STR_SWA1 STR_SWA7 STR_SWB4 STR_SWB5 STR_SWE8-STR_SWE11 = SW SPDT- APEM Série 523x: Switch unipolaire a levier
STR_UART1 = RJ11_6/6: Right Angle, Standard Profile, Offset Latch DECconnect, Flangeless PCB Jack; Ports: 1; Positions/Loaded: Port1 - 6 Offset Latch/6; PerformanceCategory: 3; PCB_Mounting: Thru-Hole; DrillSize: Nominal, Rounded to nearest 0.05mm; PCB_Layout: Complies with Manufacturer's Recommendation.; Published: 25-Jun-2002; DatasheetDocument: 18-Dec-2001; PackageDocument: 18-Dec-2001; PackageReference: 15-43-6110; Publisher: Altium Limited; ComponentLink1Description: Manufacturer Link; ComponentLink1URL: http://www.molex.com/; ComponentLink2Description: Datasheet; ComponentLink2URL: http://www.molex.com/cmc_upload/common_files/1212003_41369catalogpage.pdf; Type: RJ11_6/6
STR_Ucan = MCP2551-I/SN: High-Speed CAN Transceiver, 8-Pin SOIC, Industrial Temperature; Published: 25/11/09; DatasheetVersion: revE, Jan-2007; PackageVersion: revAW, Oct-2008; PackageReference: SOIC-SN8; Publisher: Damien Guitton; PackageDescription: 8-Lead Plastic Small Outline (SN) - Narrow, 3.90mm Body [SOIC]; Code_JEDEC: MS-012; Code_IPC: SOIC127P600-8; ComponentLink1Description: Manufacturer Link; ComponentLink1URL: http://www.microchip.com; ComponentLink2Description: Datasheet; ComponentLink2URL: http://ww1.microchip.com/downloads/en/DeviceDoc/21667E.pdf; ComponentLink3Description: Packaging Specification; ComponentLink3URL: http://ww1.microchip.com/downloads/en/PackagingSpec/00049AW.pdf